# EasyEDA Pro project DCDC_Buck_Codex_Optimized_20260618.epro

# Board PCB1
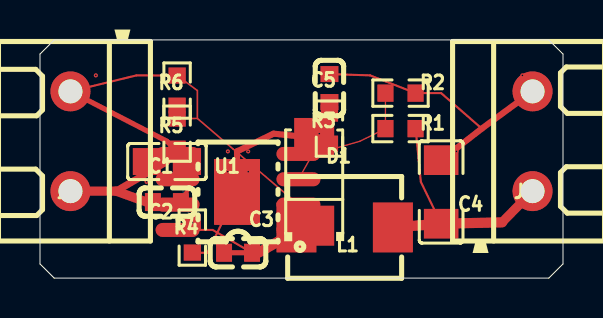
[diagram p0: board, top side]
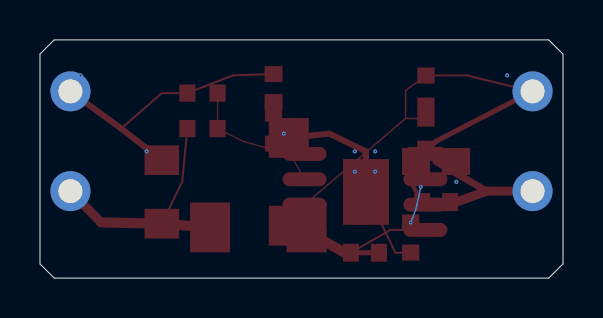
[diagram p1: board, bottom side, seen from below]

Outline 26.16 x 11.94 mm; copper layers: Top Layer, Bottom Layer. Coordinates in mm from the lower left corner of the outline.
Outline path: 0,11.23 0,0.71 0.71,0 25.45,0 26.16,0.71 26.16,11.23 25.45,11.94 0.71,11.94 0,11.23
Stack: Top Layer 0.035mm / Dielectric1 1.51mm FR4 er 4.5 / Bottom Layer 0.035mm

## Design rules (mm)
spacing copperThickness1oz (default): track to track 0.102, other pairs 0.152 to 0.3
spacing copperThickness2oz: track to track 0.203, other pairs 0.152 to 0.3
track width copperThickness1oz (default): min 0.127, default 0.254, max 2.54
track width copperThickness2oz: min 0.203, default 0.254, max 2.54
differential pair differentialPair (default): width min 0.127, default 0.254, max 2.54; gap min 0.152, default 0.152

## Placement (name value [footprint] x y rotation side)
C1  -  [C0805]  6.35 5.84 180 top
C2  100nF  [C0603]  6.35 3.81 180 top
C3  -  [C0603]  9.91 1.27 180 top
C4  -  [C1206]  20.07 4.32 270 top
C5  -  [C0603]  14.48 9.53 90 top
D1  SS34  [SMA_L4.3-W2.6-LS5.2-RD]  13.72 4.83 90 top
J1  KF301-2P接线端子  [CONN-TH_XY301V-A-5.0-2P]  1.52 6.86 90 top
J2  KF301-2P接线端子  [CONN-TH_XY301V-A-5.0-2P]  24.64 6.86 270 top
L1  10uH/3A  [IND-SMD_L5.7-W5.1]  15.24 2.54 0 top
R1  -  [R0603]  18.03 7.49 0 top
R2  -  [R0603]  18.03 9.27 180 top
R3  -  [R0603]  14.48 7.49 90 top
R4  -  [R0603]  7.62 2.03 90 top
R5  -  [R0603]  6.86 7.24 90 top
R6  -  [R0603]  6.86 9.4 90 top
U1  MP1584EN  [SOIC-8_L4.9-W3.9-P1.27-LS6.0-BL-EP3.3]  9.91 4.32 90 top

## Footprints (pads in the part's own frame, mm; a bottom-side part is the same pattern mirrored in y, then rotated)
C0603
  rect 0.8x0.9 smd: 1(-0.7,0) 2(0.7,0)
C0805
  rect 1.41x1.35 smd: 1(-1,0) 2(1,0)
C1206
  rect 1.485x1.728 smd: 1(-1.593,0) 2(1.593,0)
CONN-TH_XY301V-A-5.0-2P
  round 2 hole 1.2: 1(-2.5,0) 2(2.5,0)
IND-SMD_L5.7-W5.1
  rect 2x2.5 smd: 1(-2.413,0) 2(2.413,0)
R0603
  rect 0.806x0.864 smd: 1(-0.753,0) 2(0.753,0)
SMA_L4.3-W2.6-LS5.2-RD
  rect 2x2 smd: 1(-2.2,0) 2(2.2,0)
SOIC-8_L4.9-W3.9-P1.27-LS6.0-BL-EP3.3
  oval 0.7x2.2 smd: 1(-1.905,-3.022) 2(-0.635,-3.022) 3(0.635,-3.022) 4(1.905,-3.022) 5(1.905,3.022) 6(0.635,3.022) 7(-0.635,3.022) 8(-1.905,3.022)
  rect 3.3x2.3 smd: 9(0,0.051)

## Nets
GND: C1.1 C2.1 C4.1 C5.1 D1.2 J1.2 J2.1 R2.1 R4.1 R6.1 U1.5 U1.9
VIN: C1.2 C2.2 J1.1 R5.1 U1.7
BST: C3.1 U1.8
COMP: R3.1 U1.3
COMP_RC: C5.2 R3.2
EN: R5.2 R6.2 U1.2
FB: R1.1 R2.2 U1.4
FREQ: R4.2 U1.6
SW: C3.2 D1.1 L1.1 U1.1
VOUT: C4.2 J2.2 L1.2 R1.2

## Via types
v1: diameter 0.203, hole 0.089, Top Layer to Bottom Layer, 9 vias
v2: diameter 0.191, hole 0.089, Top Layer to Bottom Layer, 2 vias

## Routing (per net, layer and track width the routed paths; a pad name or vN(x,y) marks a point on that pad's centre or on a via; arc(x,y) is an arc through that point)
GND: length 39.5
  Top Layer w0.102: 6.86,10.15 4.83,10.16 J1.2 ; 9.85,4.32 8.38,1.27 R4.1 ; 14.48,10.23 16.51,10.16 R2.1 20.07,9.27 22.1,7.49
  Top Layer w0.203: C2.1 7.62,4.83 6.88,6.22
  Top Layer w0.254: J1.2 6.35,6.86 C1.1
  Top Layer w0.305: D1.2 11.68,7.24 9.85,6.35 9.85,4.32 ; J2.1 22.1,7.49 C4.1
  vias: v1(2.79,10.16) v1(5.33,4.83) v1(9.4,6.35) v1(9.4,5.33) v1(10.41,6.35) v1(10.41,5.33) v1(13.97,7.24) v1(20.83,6.35) v1(24.13,10.16)
VIN: length 9.2
  Top Layer w0.152: 6.35,5.84 6.86,6.48
  Top Layer w0.355: 3.81,4.36 6.35,5.84
  Top Layer w0.406: 5.33,3.81 U1.7
  Top Layer w0.457: J1.1 3.81,4.36 5.33,3.81
BST: length 4
  Top Layer w0.102: C3.1 8.64,2.41 U1.8
COMP: length 2.5
  Top Layer w0.064: 14.48,6.74 13.72,6.35 U1.3
COMP_RC: length 0.6
  Top Layer w0.064: 14.48,8.25 14.48,8.82
EN: length 10.3
  Top Layer w0.076: 6.86,7.99 7.87,8 ; 7.87,8 9.65,6.48 U1.2 ; 7.87,8 7.87,9.4 R6.2
FB: length 6.4
  Top Layer w0.064: R2.2 R1.1 16,6.86 14.22,6.35 12.93,6.22
FREQ: length 2.8
  Top Layer w0.064: v2(7.62,2.79) 7.62,2.28 ; U1.6 v2(7.11,4.57)
  Bottom Layer w0.064: v2(7.11,4.57) 7.37,3.43 v2(7.62,2.79)
SW: length 5
  Top Layer w0.254: C3.2 10.92,1.27
  Top Layer w0.508: U1.1 L1.1 ; U1.1 10.92,1.27 ; U1.1 D1.1
VOUT: length 12.7
  Top Layer w0.102: C4.2 19.05,4.83 R1.2
  Top Layer w0.457: 23.11,2.79 J2.2
  Top Layer w0.508: 23.11,2.79 C4.2 L1.2

## Copper pours and planes (outline as drawn; the poured copper is in the pictures)
GND on Top Layer: 4.06,21.39 4.08,21.52 4.13,21.68 4.22,21.83 4.34,21.95 4.48,22.04 4.65,22.09 4.78,22.1 21.64,22.1 21.77,22.09 21.93,22.04 22.08,21.95 22.2,21.83 22.29,21.68 22.34,21.52 22.35,21.39 22.35,20.52 22.34,20.39 22.29,20.23 22.2,20.08 22.08,19.96 21.93,19.87 21.77,19.82 21.64,19.81 4.78,19.81 4.65,19.82 4.48,19.87 4.34,19.96 4.22,20.08 4.13,20.23 4.08,20.39 4.06,20.52
GND on Bottom Layer: 4.06,21.39 4.08,21.52 4.13,21.68 4.22,21.83 4.34,21.95 4.48,22.04 4.65,22.09 4.78,22.1 21.64,22.1 21.77,22.09 21.93,22.04 22.08,21.95 22.2,21.83 22.29,21.68 22.34,21.52 22.35,21.39 22.35,20.52 22.34,20.39 22.29,20.23 22.2,20.08 22.08,19.96 21.93,19.87 21.77,19.82 21.64,19.81 4.78,19.81 4.65,19.82 4.48,19.87 4.34,19.96 4.22,20.08 4.13,20.23 4.08,20.39 4.06,20.52
